# Altium schematic sheet RFRadioSystem.SchDoc
size A; SheetNumber: 1; SheetTotal: 6
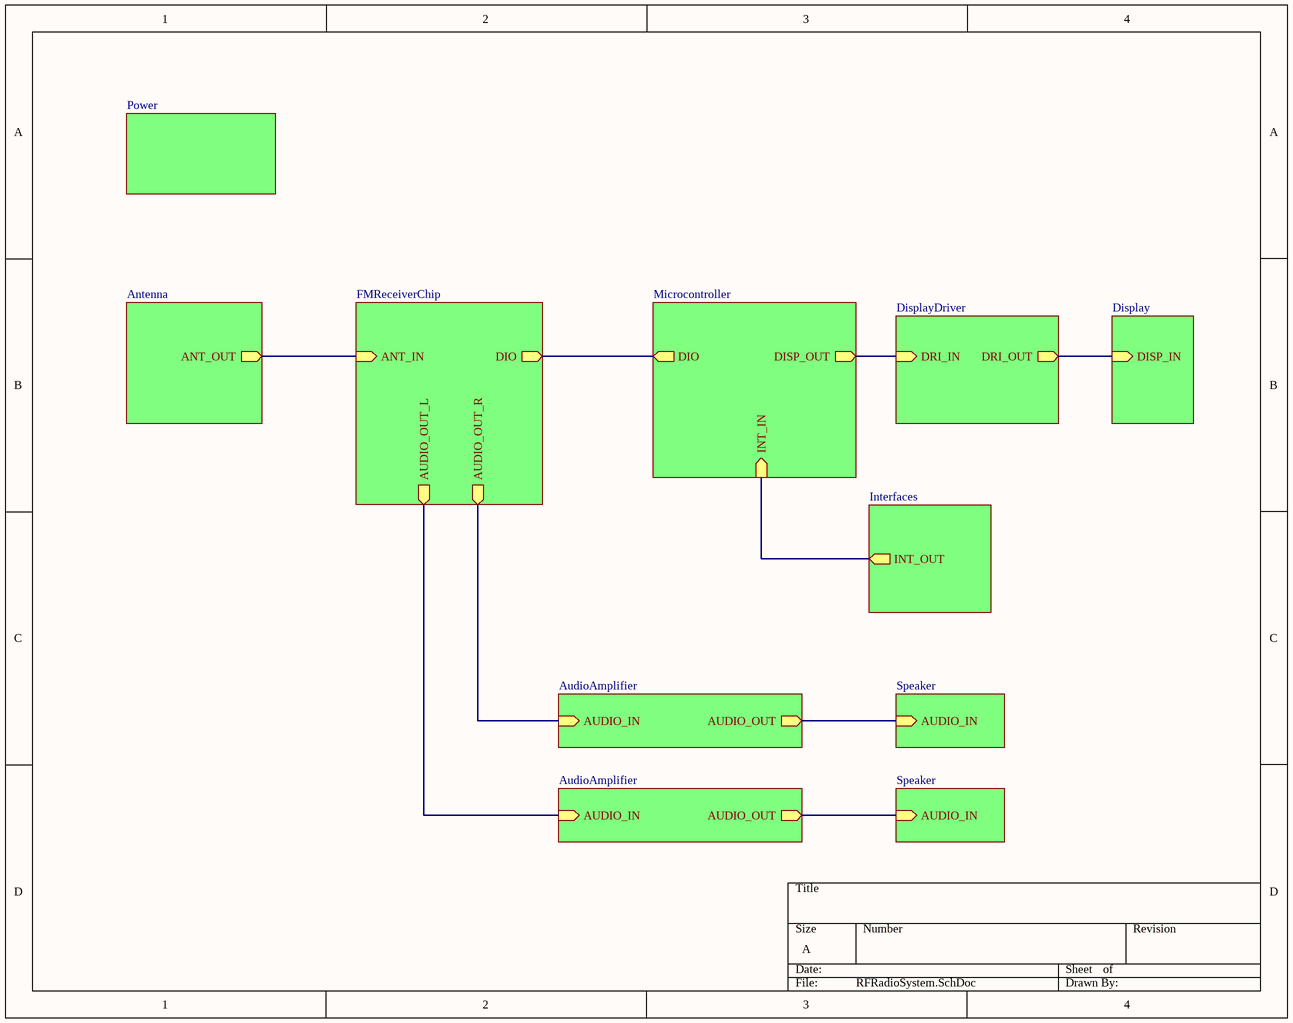
[diagram p0: RFRadioSystem.SchDoc]

## Sub-sheets
Antenna = File Name: ANT_OUT (out)
AudioAmplifier = File Name: AUDIO_OUT (out), AUDIO_IN (in)
AudioAmplifier = File Name: AUDIO_OUT (out), AUDIO_IN (in)
Display = File Name: DISP_IN (in)
DisplayDriver = File Name: DRI_OUT (out), DRI_IN (in)
FMReceiverChip = File Name: DIO (out), AUDIO_OUT_R (out), AUDIO_OUT_L (out), ANT_IN (in)
Interfaces = File Name: INT_OUT (out)
Microcontroller = File Name: DIO (out), DISP_OUT (out), INT_IN (in)
Power = File Name: no entries
Speaker = File Name: AUDIO_IN (in)
Speaker = File Name: AUDIO_IN (in)

## Nets
(unnamed): sheet FMReceiverChip/DIO, sheet Microcontroller/DIO
(unnamed): sheet FMReceiverChip/AUDIO_OUT_R, sheet AudioAmplifier/AUDIO_IN
(unnamed): sheet FMReceiverChip/AUDIO_OUT_L, sheet AudioAmplifier/AUDIO_IN
(unnamed): sheet FMReceiverChip/ANT_IN, sheet Antenna/ANT_OUT
(unnamed): sheet AudioAmplifier/AUDIO_OUT, sheet Speaker/AUDIO_IN
(unnamed): sheet AudioAmplifier/AUDIO_OUT, sheet Speaker/AUDIO_IN
(unnamed): sheet Microcontroller/DISP_OUT, sheet DisplayDriver/DRI_IN
(unnamed): sheet Microcontroller/INT_IN, sheet Interfaces/INT_OUT
(unnamed): sheet DisplayDriver/DRI_OUT, sheet Display/DISP_IN